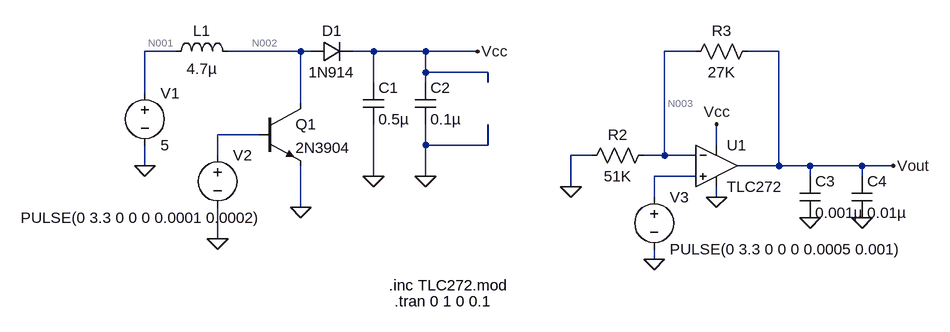
[diagram p0: schematic Draft3.asc]
Draft3.asc, the LTspice schematic file:
Version 4
SHEET 1 1732 680
WIRE 80 64 32 64
WIRE 272 64 160 64
WIRE 288 64 272 64
WIRE 384 64 352 64
WIRE 464 64 384 64
WIRE 544 64 464 64
WIRE 880 64 832 64
WIRE 1008 64 960 64
WIRE 464 96 464 64
WIRE 560 96 464 96
WIRE 384 112 384 64
WIRE 464 112 464 96
WIRE 560 112 560 96
WIRE 32 128 32 64
WIRE 272 144 272 64
WIRE 208 192 144 192
WIRE 464 208 464 176
WIRE 560 208 560 176
WIRE 560 208 464 208
WIRE 912 208 912 176
WIRE 144 224 144 192
WIRE 720 224 688 224
WIRE 832 224 832 64
WIRE 832 224 800 224
WIRE 880 224 832 224
WIRE 32 240 32 208
WIRE 1008 240 1008 64
WIRE 1008 240 944 240
WIRE 1056 240 1008 240
WIRE 1136 240 1056 240
WIRE 1184 240 1136 240
WIRE 384 256 384 176
WIRE 464 256 464 208
WIRE 880 256 816 256
WIRE 1056 256 1056 240
WIRE 1136 256 1136 240
WIRE 688 272 688 224
WIRE 816 288 816 256
WIRE 912 288 912 272
WIRE 272 304 272 240
WIRE 144 352 144 304
WIRE 816 384 816 368
FLAG 384 256 0
FLAG 272 304 0
FLAG 32 240 0
FLAG 144 352 0
FLAG 544 64 Vcc
FLAG 912 176 Vcc
FLAG 912 288 0
FLAG 816 384 0
FLAG 688 272 0
FLAG 1184 240 Vout
FLAG 464 256 0
FLAG 1056 320 0
FLAG 1136 320 0
SYMBOL voltage 32 112 R0
WINDOW 123 0 0 Left 0
WINDOW 39 0 0 Left 0
SYMATTR InstName V1
SYMATTR Value 5
SYMBOL ind 64 80 R270
WINDOW 0 32 56 VTop 2
WINDOW 3 5 56 VBottom 2
SYMATTR InstName L1
SYMATTR Value 4.7µ
SYMBOL npn 208 144 R0
SYMATTR InstName Q1
SYMATTR Value 2N3904
SYMBOL voltage 144 208 R0
WINDOW 3 -303 112 Left 2
WINDOW 123 0 0 Left 0
WINDOW 39 0 0 Left 0
SYMATTR Value PULSE(0 3.3 0 0 0 0.0001 0.0002)
SYMATTR InstName V2
SYMBOL diode 288 80 R270
WINDOW 0 32 32 VTop 2
WINDOW 3 0 32 VBottom 2
SYMATTR InstName D1
SYMATTR Value 1N914
SYMBOL OpAmps\\opamp2 912 176 R0
SYMATTR InstName U1
SYMATTR Value TLC272
SYMBOL voltage 816 272 R0
WINDOW 123 0 0 Left 0
WINDOW 39 0 0 Left 0
SYMATTR InstName V3
SYMATTR Value PULSE(0 3.3 0 0 0 0.0005 0.001)
SYMBOL res 816 208 R90
WINDOW 0 0 56 VBottom 2
WINDOW 3 32 56 VTop 2
SYMATTR InstName R2
SYMATTR Value 51K
SYMBOL res 976 48 R90
WINDOW 0 0 56 VBottom 2
WINDOW 3 32 56 VTop 2
SYMATTR InstName R3
SYMATTR Value 27K
SYMBOL cap 448 112 R0
SYMATTR InstName C2
SYMATTR Value 0.1µ
SYMBOL cap 1040 256 R0
SYMATTR InstName C3
SYMATTR Value 0.001µ
SYMBOL cap 1120 256 R0
SYMATTR InstName C4
SYMATTR Value 0.01µ
SYMBOL cap 368 112 R0
SYMATTR InstName C1
SYMATTR Value 0.5µ
TEXT 416 448 Left 2 !.tran 0 1 0 0.1
TEXT 408 424 Left 2 !.inc TLC272.mod

The netlist it stands for:
* Draft3.asc
V1 N001 0 5
L1 N001 N002 4.7µ
Q1 N002 N004 0 0 2N3904
V2 N004 0 PULSE(0 3.3 0 0 0 0.0001 0.0002)
D1 N002 Vcc 1N914
XU1 N005 N003 Vcc 0 Vout TLC272  ; pins In+ In- V+ V- OUT
V3 N005 0 PULSE(0 3.3 0 0 0 0.0005 0.001)
R2 N003 0 51K
R3 Vout N003 27K
C2 Vcc 0 0.1µ
C3 Vout 0 0.001µ
C4 Vout 0 0.01µ
C1 Vcc 0 0.5µ
.model D D
.lib standard.dio
.model NPN NPN
.model PNP PNP
.lib standard.bjt
.tran 0 1 0 0.1
.inc TLC272.mod
.backanno
.end

* Results of the author's LTspice run, read from the files saved beside the schematic
* Operating Point, zero values left out:
*   V(n001) = 5 V
*   V(n002) = 5 V
*   V(vcc) = 4.438 V
*   V(vout) = 84.89 mV
*   V(n003) = 55.51 mV
*   Ic(Q1) = 5.009 pA
*   Ib(Q1) = -5.002 pA
*   I(D1) = 605.9 µA
*   I(L1) = 605.9 µA
*   I(R3) = 1.088 µA
*   I(R2) = 1.088 µA
*   I(V3) = 7.337 pA
*   I(V2) = 5.002 pA
*   I(V1) = -605.9 µA
*   Ix(u1:1) = -7.337 pA
*   Ix(u1:3) = 605.9 µA
*   Ix(u1:4) = -589.5 µA
*   Ix(u1:5) = -1.088 µA